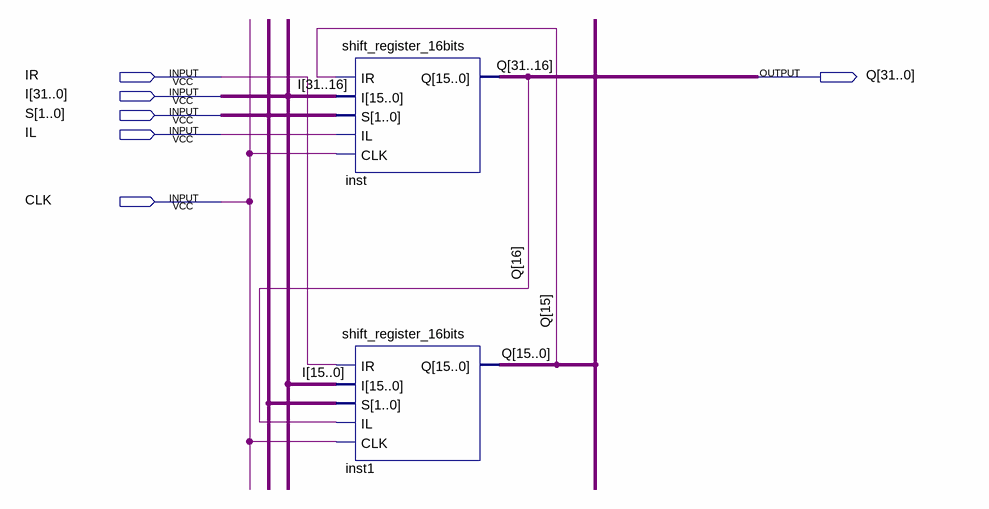
[diagram p0: schematic sheet]
// Quartus schematic shift_register_32bits.bdf as structural Verilog: 2 symbols, 6 pins
module shift_register_32bits (
  input  IR,
  input  [31:0] I,
  input  [1:0] S,
  input  IL,
  input  CLK,
  output [31:0] Q
);

  shift_register_16bits inst (.IR(Q[15]), .I(I[31:16]), .S(S), .IL(IL), .CLK(CLK), .Q(Q[31:16]));
  shift_register_16bits inst1 (.IR(IR), .I(I[15:0]), .S(S), .IL(Q[16]), .CLK(CLK), .Q(Q[15:0]));
endmodule
